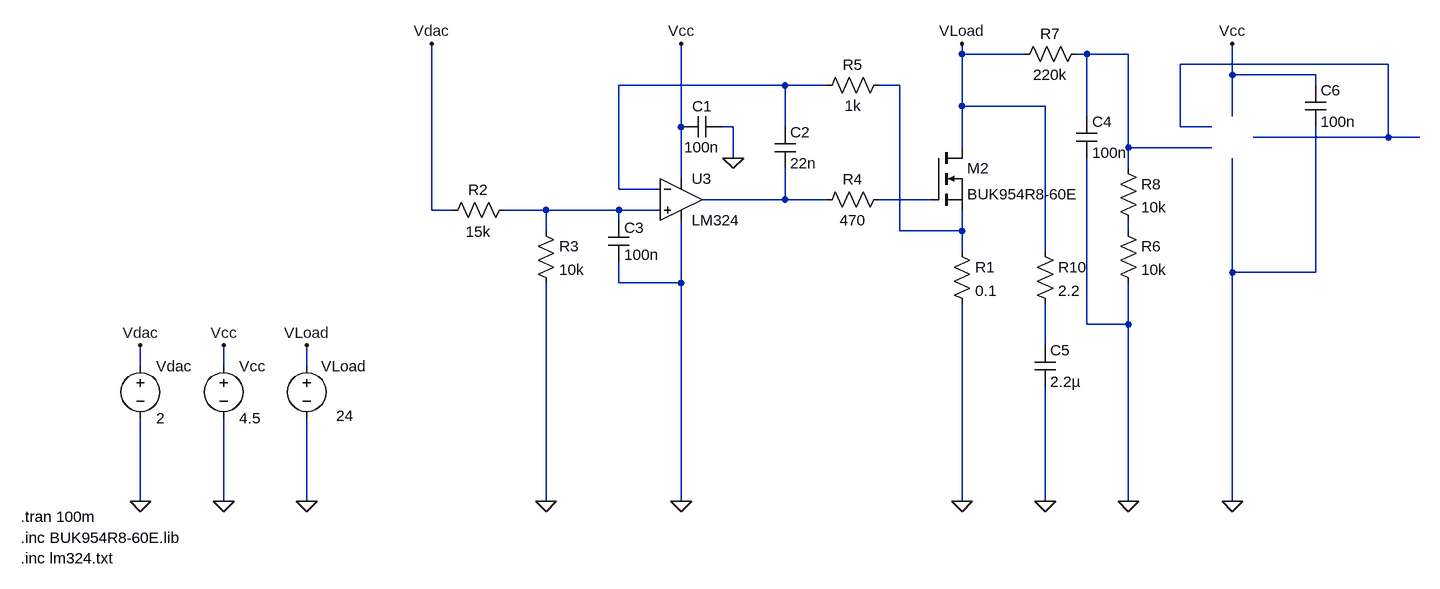
[diagram p0: schematic Spice Model - Version 3 - LM324.asc]
Spice Model - Version 3 - LM324.asc, the LTspice schematic file:
Version 4
SHEET 1 916 936
WIRE 208 -16 208 -32
WIRE 304 -16 208 -16
WIRE 400 -16 384 -16
WIRE 464 -16 400 -16
WIRE 864 0 544 0
WIRE 624 16 624 -32
WIRE 752 16 624 16
WIRE -64 32 -320 32
WIRE 0 32 -64 32
WIRE 112 32 80 32
WIRE 752 32 752 16
WIRE 208 64 208 -16
WIRE 336 64 208 64
WIRE 400 80 400 -16
WIRE 624 80 624 16
WIRE -224 96 -224 -32
WIRE -144 96 -160 96
WIRE -64 96 -64 32
WIRE 544 96 544 0
WIRE 592 96 544 96
WIRE 864 112 864 0
WIRE 864 112 656 112
WIRE 912 112 864 112
WIRE 208 128 208 64
WIRE 464 128 464 -16
WIRE 592 128 464 128
WIRE -144 144 -144 96
WIRE 464 160 464 128
WIRE -224 176 -224 96
WIRE -320 192 -320 32
WIRE -256 192 -320 192
WIRE -64 208 -64 160
WIRE -64 208 -192 208
WIRE 0 208 -64 208
WIRE 160 208 80 208
WIRE -608 224 -608 -32
WIRE -576 224 -608 224
WIRE -432 224 -496 224
WIRE -320 224 -432 224
WIRE -256 224 -320 224
WIRE -320 240 -320 224
WIRE -432 256 -432 224
WIRE 112 256 112 32
WIRE 208 256 208 224
WIRE 208 256 112 256
WIRE 464 256 464 240
WIRE 208 288 208 256
WIRE 336 288 336 64
WIRE 624 320 624 144
WIRE 752 320 752 96
WIRE 752 320 624 320
WIRE -320 336 -320 304
WIRE -224 336 -224 240
WIRE -224 336 -320 336
WIRE 400 400 400 144
WIRE 464 400 464 336
WIRE 464 400 400 400
WIRE 336 432 336 368
WIRE -1056 464 -1056 432
WIRE -928 464 -928 432
WIRE -800 464 -800 432
WIRE -1056 672 -1056 544
WIRE -928 672 -928 544
WIRE -800 672 -800 544
WIRE -432 672 -432 336
WIRE -224 672 -224 336
WIRE 208 672 208 368
WIRE 336 672 336 496
WIRE 464 672 464 400
WIRE 624 672 624 320
FLAG -224 672 0
FLAG -1056 672 0
FLAG -800 672 0
FLAG 208 672 0
FLAG -928 672 0
FLAG -432 672 0
FLAG -928 432 Vcc
FLAG -224 -32 Vcc
FLAG -800 432 VLoad
FLAG 208 -32 VLoad
FLAG -1056 432 Vdac
FLAG -608 -32 Vdac
FLAG -144 144 0
FLAG 464 672 0
FLAG 336 672 0
FLAG 624 -32 Vcc
FLAG 624 672 0
SYMBOL voltage -928 448 R0
WINDOW 123 0 0 Left 2
WINDOW 39 0 0 Left 2
SYMATTR InstName Vcc
SYMATTR Value 4.5
SYMBOL voltage -800 448 R0
WINDOW 0 57 32 Bottom 2
WINDOW 3 59 108 Bottom 2
WINDOW 123 0 0 Left 2
WINDOW 39 0 0 Left 2
SYMATTR InstName VLoad
SYMATTR Value 24
SYMBOL nmos 160 128 R0
SYMATTR InstName M2
SYMATTR Value BUK954R8-60E
SYMATTR Prefix X
SYMBOL cap -160 80 R90
WINDOW 0 0 32 VBottom 2
WINDOW 3 32 32 VTop 2
SYMATTR InstName C1
SYMATTR Value 100n
SYMBOL res 192 272 R0
SYMATTR InstName R1
SYMATTR Value 0.1
SYMATTR SpiceLine tol=1
SYMBOL res -592 240 R270
WINDOW 0 32 56 VTop 2
WINDOW 3 -2 56 VBottom 2
SYMATTR InstName R2
SYMATTR Value 15k
SYMBOL res -448 240 R0
SYMATTR InstName R3
SYMATTR Value 10k
SYMBOL res -16 224 R270
WINDOW 0 32 56 VTop 2
WINDOW 3 0 56 VBottom 2
SYMATTR InstName R4
SYMATTR Value 470
SYMBOL res 96 16 R90
WINDOW 0 0 56 VBottom 2
WINDOW 3 32 56 VTop 2
SYMATTR InstName R5
SYMATTR Value 1k
SYMBOL cap -80 96 R0
SYMATTR InstName C2
SYMATTR Value 22n
SYMBOL cap -304 304 R180
WINDOW 0 -23 53 Left 2
WINDOW 3 -46 11 Left 2
SYMATTR InstName C3
SYMATTR Value 100n
SYMBOL voltage -1056 448 R0
WINDOW 123 0 0 Left 2
WINDOW 39 0 0 Left 2
SYMATTR InstName Vdac
SYMATTR Value 2
SYMBOL res 400 -32 R90
WINDOW 0 0 56 VBottom 2
WINDOW 3 32 56 VTop 2
SYMATTR InstName R7
SYMATTR Value 220k
SYMBOL res 448 144 R0
SYMATTR InstName R8
SYMATTR Value 10k
SYMBOL cap 384 80 R0
SYMATTR InstName C4
SYMATTR Value 100n
SYMBOL res 320 272 R0
SYMATTR InstName R10
SYMATTR Value 2.2
SYMBOL cap 320 432 R0
SYMATTR InstName C5
SYMATTR Value 2.2µ
SYMBOL cap 736 32 R0
SYMATTR InstName C6
SYMATTR Value 100n
SYMBOL res 448 240 R0
SYMATTR InstName R6
SYMATTR Value 10k
SYMBOL Opamps\\opamp2 -224 144 R0
SYMATTR InstName U3
SYMATTR Value LM324
TEXT -1240 696 Left 2 !.tran 100m
TEXT -1240 728 Left 2 !.inc BUK954R8-60E.lib
TEXT -1240 760 Left 2 !.inc lm324.txt

The netlist it stands for:
* Spice Model - Version 3 - LM324.asc
Vcc Vcc 0 4.5
VLoad VLoad 0 24
XM2 VLoad N006 N004 BUK954R8-60E  ; pins D G S
C1 0 Vcc 100n
R1 N004 0 0.1 tol=1
R2 Vdac N007 15k
R3 N007 0 10k
R4 N005 N006 470
R5 N004 N003 1k
C2 N003 N005 22n
C3 0 N007 100n
Vdac Vdac 0 2
R7 N001 VLoad 220k
R8 N001 N008 10k
C4 N001 0 100n
R10 VLoad N009 2.2
C5 N009 0 2.2µ
C6 Vcc 0 100n
R6 N008 0 10k
XU3 N007 N003 Vcc 0 N005 LM324  ; pins In+ In- V+ V- OUT
.tran 100m
.inc BUK954R8-60E.lib
.inc lm324.txt
.backanno
.end